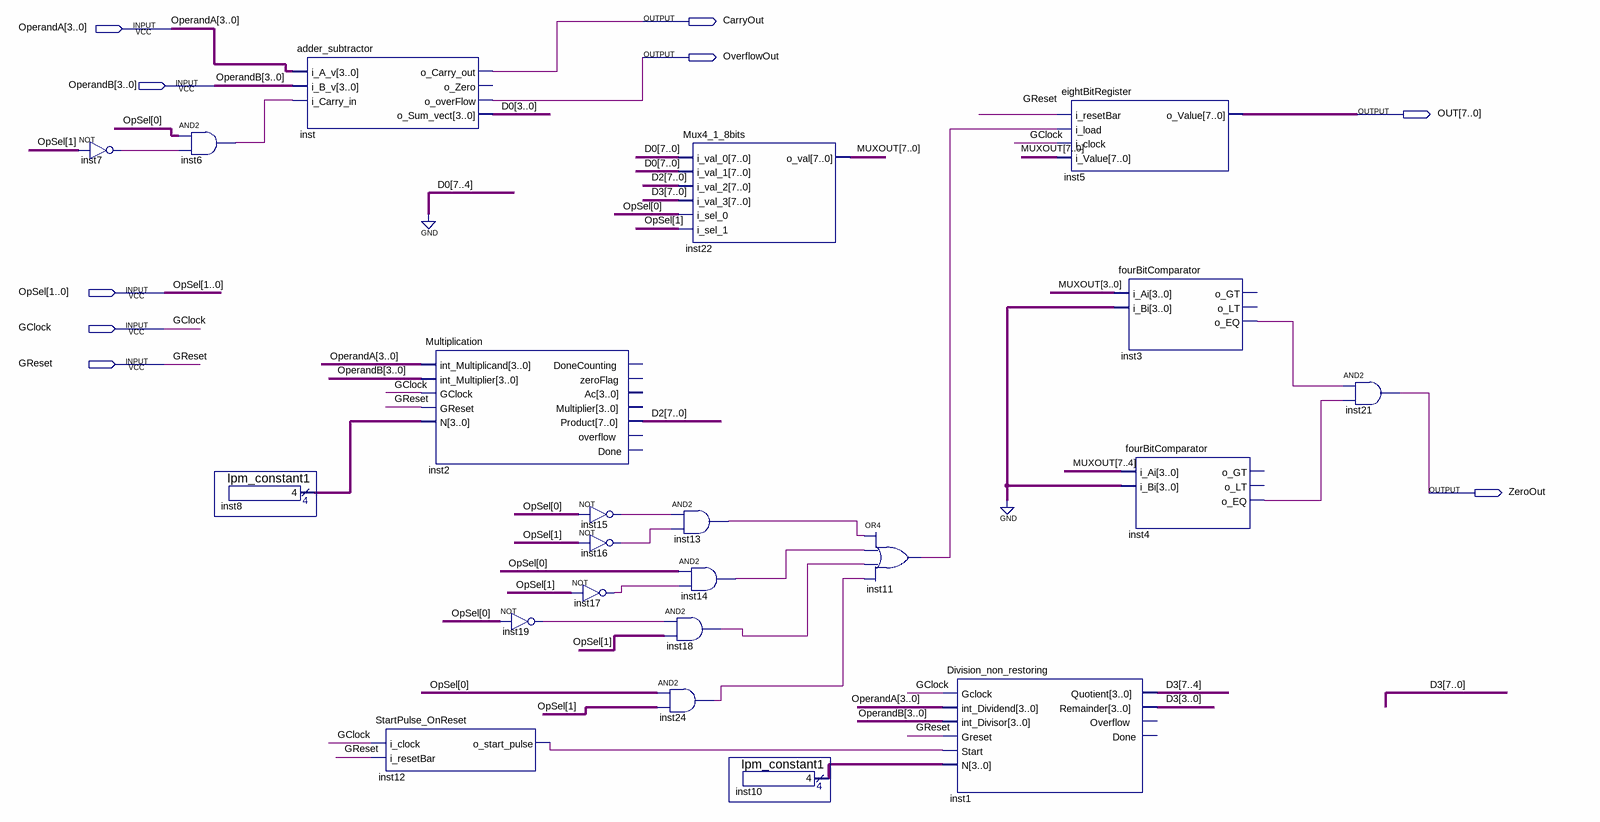
[diagram p0: schematic sheet]
// Quartus schematic ALU.bdf as structural Verilog: 22 symbols, 9 pins
module ALU (
  input  [3:0] OperandA,
  input  [3:0] OperandB,
  input  [1:0] OpSel,
  input  GClock,
  input  GReset,
  output CarryOut,
  output OverflowOut,
  output [7:0] OUT,
  output ZeroOut
);

  wire inst3_o_eq, inst4_o_eq, inst6_out, inst7_out, inst11_out, inst12_o_start_pulse, inst13_out,
       inst14_out, inst15_out, inst16_out, inst17_out, inst18_out, inst19_out, inst24_out;
  wire [3:0] D0, inst8_result, inst10_result;
  wire [7:0] D2, D3, MUXOUT;

  not inst7 (inst7_out, OpSel[1]);
  and inst6 (inst6_out, OpSel[0], inst7_out);
  lpm_constant1 inst8 (.result(inst8_result));
  adder_subtractor inst (
    .i_A_v(OperandA), .i_B_v(OperandB), .i_Carry_in(inst6_out), .o_Carry_out(CarryOut),
    .o_overFlow(OverflowOut), .o_Sum_vect(D0));  // open: o_Zero
  StartPulse_OnReset inst12 (.i_clock(GClock), .i_resetBar(GReset), .o_start_pulse(inst12_o_start_pulse));
  Multiplication inst2 (
    .int_Multiplicand(OperandA), .int_Multiplier(OperandB), .GClock(GClock), .GReset(GReset),
    .N(inst8_result), .Product(D2));  // open: DoneCounting, zeroFlag, Ac, Multiplier, overflow, Done
  not inst19 (inst19_out, OpSel[0]);
  not inst15 (inst15_out, OpSel[0]);
  not inst16 (inst16_out, OpSel[1]);
  not inst17 (inst17_out, OpSel[1]);
  Mux4_1_8bits inst22 (
    .i_val_0({4'b0000, D0}), .i_val_1({4'b0000, D0}), .i_val_2(D2), .i_val_3(D3), .i_sel_0(OpSel[0]),
    .i_sel_1(OpSel[1]), .o_val(MUXOUT));
  and inst13 (inst13_out, inst15_out, inst16_out);
  and inst14 (inst14_out, OpSel[0], inst17_out);
  and inst18 (inst18_out, inst19_out, OpSel[1]);
  and inst24 (inst24_out, OpSel[0], OpSel[1]);
  lpm_constant1 inst10 (.result(inst10_result));
  or inst11 (inst11_out, inst13_out, inst14_out, inst18_out, inst24_out);
  Division_non_restoring inst1 (
    .Gclock(GClock), .int_Dividend(OperandA), .int_Divisor(OperandB), .Greset(GReset),
    .Start(inst12_o_start_pulse), .N(inst10_result), .Quotient(D3[7:4]), .Remainder(D3[3:0]));  // open: Overflow, Done
  eightBitRegister inst5 (.i_resetBar(GReset), .i_load(inst11_out), .i_clock(GClock), .i_Value(MUXOUT), .o_Value(OUT));
  fourBitComparator inst3 (.i_Ai(MUXOUT[3:0]), .i_Bi(4'b0000), .o_EQ(inst3_o_eq));  // open: o_GT, o_LT
  fourBitComparator inst4 (.i_Ai(MUXOUT[7:4]), .i_Bi(4'b0000), .o_EQ(inst4_o_eq));  // open: o_GT, o_LT
  and inst21 (ZeroOut, inst3_o_eq, inst4_o_eq);
endmodule
